# Altium project 435MHz_LNA.PrjPCB
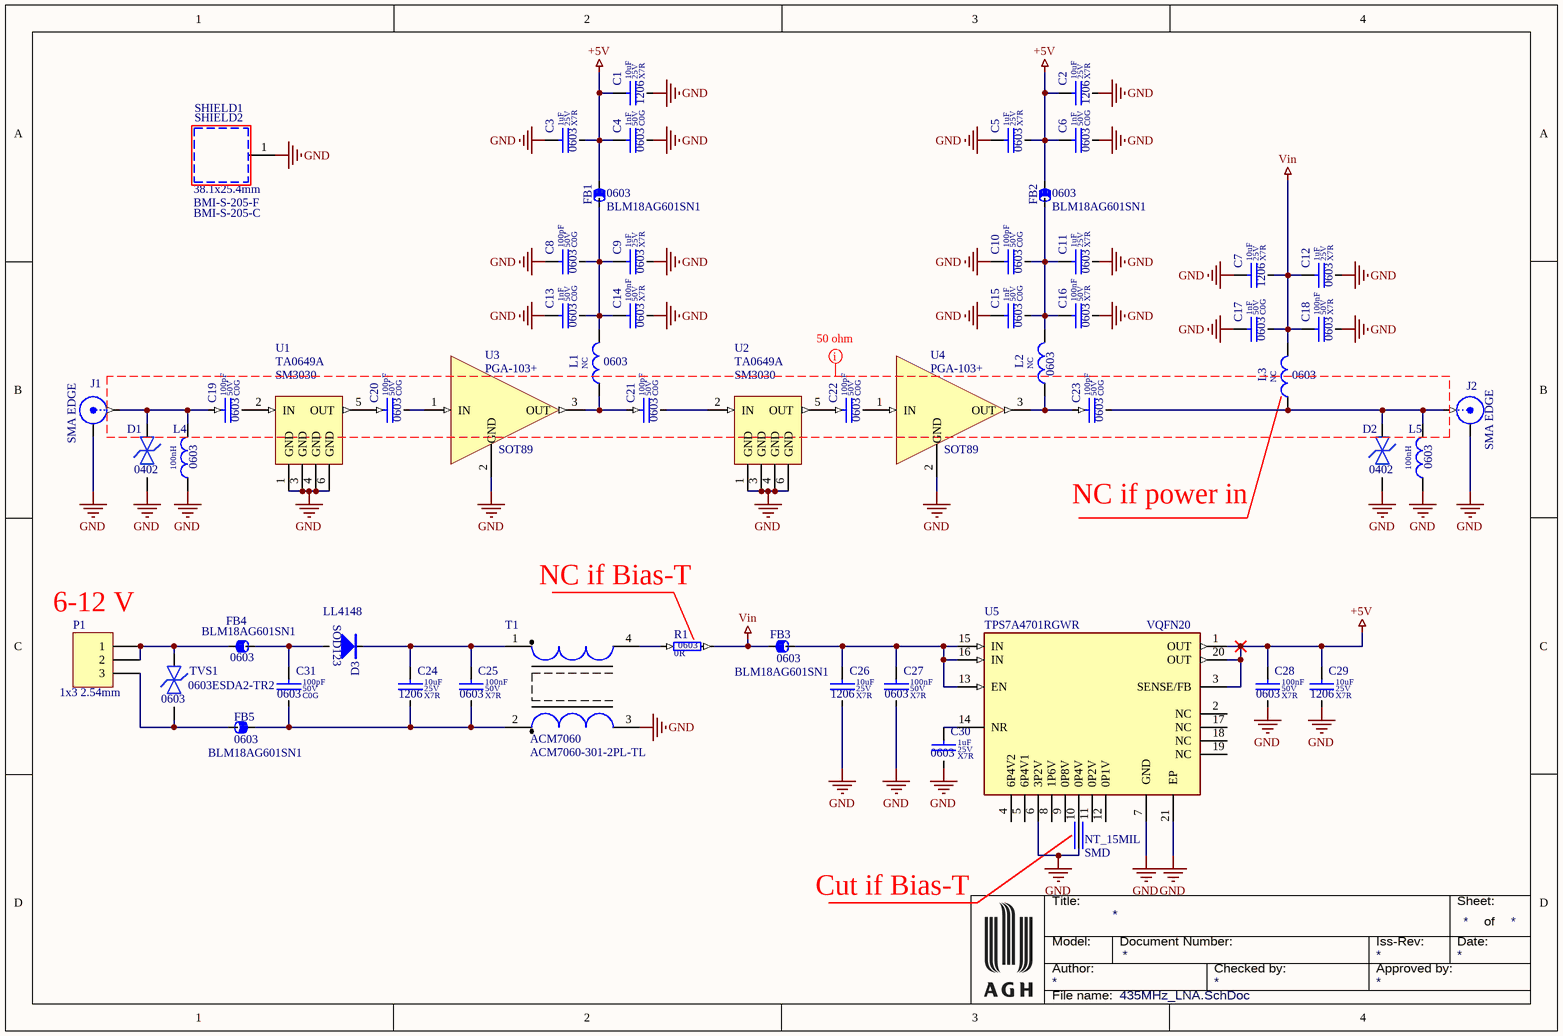
[diagram p0: 435MHz_LNA.SchDoc]
1 sheet, 58 parts. Net scope: global (net labels, ports and power ports of the same name join across sheets).
Board file: 435MHz_LNA.PcbDoc

## Sheet 435MHz_LNA.SchDoc
size A4

### Parts
C1  value 10uF  Dielectric: X7R  Voltage: 25V  SCH_Footprint: 1206  [C_1206_3216]  (hidden comment: Ceramic X7R)
C2  value 10uF  Dielectric: X7R  Voltage: 25V  SCH_Footprint: 1206  [C_1206_3216]  (hidden comment: Ceramic X7R)
C3  value 1uF  Dielectric: X7R  Voltage: 25V  SCH_Footprint: 0603  [C_0603_1608]  (hidden comment: Ceramic X7R)
C4  value 1nF  Dielectric: C0G  Voltage: 50V  SCH_Footprint: 0603  [C_0603_1608]  (hidden comment: Ceramic C0G)
C5  value 1uF  Dielectric: X7R  Voltage: 25V  SCH_Footprint: 0603  [C_0603_1608]  (hidden comment: Ceramic X7R)
C6  value 1nF  Dielectric: C0G  Voltage: 50V  SCH_Footprint: 0603  [C_0603_1608]  (hidden comment: Ceramic C0G)
C7  value 10uF  Dielectric: X7R  Voltage: 25V  SCH_Footprint: 1206  [C_1206_3216]  (hidden comment: Ceramic X7R)
C8  value 100pF  Dielectric: C0G  Voltage: 50V  SCH_Footprint: 0603  [C_0603_1608]  (hidden comment: Ceramic C0G)
C9  value 1uF  Dielectric: X7R  Voltage: 25V  SCH_Footprint: 0603  [C_0603_1608]  (hidden comment: Ceramic X7R)
C10  value 100pF  Dielectric: C0G  Voltage: 50V  SCH_Footprint: 0603  [C_0603_1608]  (hidden comment: Ceramic C0G)
C11  value 1uF  Dielectric: X7R  Voltage: 25V  SCH_Footprint: 0603  [C_0603_1608]  (hidden comment: Ceramic X7R)
C12  value 1uF  Dielectric: X7R  Voltage: 25V  SCH_Footprint: 0603  [C_0603_1608]  (hidden comment: Ceramic X7R)
C13  value 1nF  Dielectric: C0G  Voltage: 50V  SCH_Footprint: 0603  [C_0603_1608]  (hidden comment: Ceramic C0G)
C14  value 100nF  Dielectric: X7R  Voltage: 50V  SCH_Footprint: 0603  [C_0603_1608]  (hidden comment: Ceramic X7R)
C15  value 1nF  Dielectric: C0G  Voltage: 50V  SCH_Footprint: 0603  [C_0603_1608]  (hidden comment: Ceramic C0G)
C16  value 100nF  Dielectric: X7R  Voltage: 50V  SCH_Footprint: 0603  [C_0603_1608]  (hidden comment: Ceramic X7R)
C17  value 1nF  Dielectric: C0G  Voltage: 50V  SCH_Footprint: 0603  [C_0603_1608]  (hidden comment: Ceramic C0G)
C18  value 100nF  Dielectric: X7R  Voltage: 50V  SCH_Footprint: 0603  [C_0603_1608]  (hidden comment: Ceramic X7R)
C19  value 100pF  Dielectric: C0G  Voltage: 50V  SCH_Footprint: 0603  [C_0603_1608]  (hidden comment: Ceramic C0G)
C20  value 100pF  Dielectric: C0G  Voltage: 50V  SCH_Footprint: 0603  [C_0603_1608]  (hidden comment: Ceramic C0G)
C21  value 100pF  Dielectric: C0G  Voltage: 50V  SCH_Footprint: 0603  [C_0603_1608]  (hidden comment: Ceramic C0G)
C22  value 100pF  Dielectric: C0G  Voltage: 50V  SCH_Footprint: 0603  [C_0603_1608]  (hidden comment: Ceramic C0G)
C23  value 100pF  Dielectric: C0G  Voltage: 50V  SCH_Footprint: 0603  [C_0603_1608]  (hidden comment: Ceramic C0G)
C24  value 10uF  Dielectric: X7R  Voltage: 25V  SCH_Footprint: 1206  [C_1206_3216]  (hidden comment: Ceramic X7R)
C25  value 100nF  Dielectric: X7R  Voltage: 50V  SCH_Footprint: 0603  [C_0603_1608]  (hidden comment: Ceramic X7R)
C26  value 10uF  Dielectric: X7R  Voltage: 25V  SCH_Footprint: 1206  [C_1206_3216]  (hidden comment: Ceramic X7R)
C27  value 100nF  Dielectric: X7R  Voltage: 50V  SCH_Footprint: 0603  [C_0603_1608]  (hidden comment: Ceramic X7R)
C28  value 100nF  Dielectric: X7R  Voltage: 50V  SCH_Footprint: 0603  [C_0603_1608]  (hidden comment: Ceramic X7R)
C29  value 10uF  Dielectric: X7R  Voltage: 25V  SCH_Footprint: 1206  [C_1206_3216]  (hidden comment: Ceramic X7R)
C30  value 1uF  Dielectric: X7R  Voltage: 25V  SCH_Footprint: 0603  [C_0603_1608]  (hidden comment: Ceramic X7R)
C31  value 100pF  Dielectric: C0G  Voltage: 50V  SCH_Footprint: 0603  [C_0603_1608]  (hidden comment: Ceramic C0G)
D1  SCH_Footprint: 0402  [D_BI_0402_1005]  (hidden comment: ESD Suppressors / TVS Diodes)
D2  SCH_Footprint: 0402  [D_BI_0402_1005]  (hidden comment: ESD Suppressors / TVS Diodes)
D3  value LL4148  [SOD123]  (hidden comment: 1N4148W)
FB1  value BLM18AG601SN1  SCH_Footprint: 0603  [FB_0603_1608]  (hidden comment: Ferrite bead)
FB2  value BLM18AG601SN1  SCH_Footprint: 0603  [FB_0603_1608]  (hidden comment: Ferrite bead)
FB3  value BLM18AG601SN1  SCH_Footprint: 0603  [FB_0603_1608]  (hidden comment: Ferrite bead)
FB4  value BLM18AG601SN1  SCH_Footprint: 0603  [FB_0603_1608]  (hidden comment: Ferrite bead)
FB5  value BLM18AG601SN1  SCH_Footprint: 0603  [FB_0603_1608]  (hidden comment: Ferrite bead)
J1  SMA EDGE  [J_SMA_EDGE_6.25]
J2  SMA EDGE  [J_SMA_EDGE_6.25]
L1  value NC  SCH_Footprint: 0603  [L_0603_1608]  (hidden comment: L)
L2  value NC  SCH_Footprint: 0603  [L_0603_1608]  (hidden comment: L)
L3  value NC  SCH_Footprint: 0603  [L_0603_1608]  (hidden comment: L)
L4  value 100nH  SCH_Footprint: 0603  [L_0603_1608]  (hidden comment: Inductor)
L5  value 100nH  SCH_Footprint: 0603  [L_0603_1608]  (hidden comment: Inductor)
NT1  value NT_15MIL  SCH_Footprint: SMD  [NT_15MIL]  (hidden comment: NETTIE 15MIL)  (net tie, no BOM)
P1  SCH_Footprint: 1x3 2.54mm  [P_HEADER_1x3_2.54]  (hidden comment: Goldpin)
R1  value 0R  SCH_Footprint: 0603  [R_0603_1608]  (hidden comment: Resistor)
SHIELD1  value BMI-S-205-C  [BMI-S-205-C]  (hidden comment: EMI Shield Cover)
SHIELD2  value BMI-S-205-F  SCH_Footprint: 38.1x25.4mm  [BMI-S-205-F]  (hidden comment: EMI Shield)
T1  value ACM7060-301-2PL-TL  [ACM7060]  (hidden comment: Common mode filter)
TVS1  value 0603ESDA2-TR2  SCH_Footprint: 0603  [R_0603_1608]  (hidden comment: 0603ESDA2)
U1  SCH_Footprint: SM3030  [SAW_DCC6_SM3030-6_3x3]  (hidden comment: TA0649A)
U2  SCH_Footprint: SM3030  [SAW_DCC6_SM3030-6_3x3]  (hidden comment: TA0649A)
U3  value PGA-103+  SCH_Footprint: SOT89  [SOT89_TO-243AA_N]  (hidden comment: PGA103+)
U4  value PGA-103+  SCH_Footprint: SOT89  [SOT89_TO-243AA_N]  (hidden comment: PGA103+)
U5  SCH_Footprint: VQFN20  [QFN20_5x5]  (hidden comment: TPS7A4701RGWR)

### Nets
+5V: C1.1 C2.1 C3.2 C4.1 C5.2 C6.1 C28.1 C29.1 FB1.1 FB2.1 U5.1(OUT) U5.3(SENSE/FB) U5.20(OUT)
GND: C1.2 C2.2 C3.1 C4.2 C5.1 C6.2 C7.1 C8.1 C9.2 C10.1 C11.2 C12.2 C13.1 C14.2 C15.1 C16.2 C17.1 C18.2 C26.2 C27.2 C28.2 C29.2 C30.2 D1.2 D2.2 J1.2(Y) J2.2(Y) L4.1 L5.1 NT1.1 SHIELD2.1(shield) T1.3 U1.1(GND) U1.3(GND) U1.4(GND) U1.6(GND) U2.1(GND) U2.3(GND) U2.4(GND) U2.6(GND) U3.2(GND) U4.2(GND) U5.6(3P2V) U5.7(GND) U5.21(EP)
Vin: C7.2 C12.1 C17.2 C18.1 FB3.1 L3.2 R1.2
NetC8_2: C8.2 C9.1 C13.2 C14.1 FB1.2 L1.2
NetC10_2: C10.2 C11.1 C15.2 C16.1 FB2.2 L2.2
NetC19_1: C19.1 D1.1 J1.1(X) L4.2
NetC19_2: C19.2 U1.2(IN)
NetC20_1: C20.1 U1.5(OUT)
NetC20_2: C20.2 U3.1(IN)
NetC21_1: C21.1 L1.1 U3.3(OUT)
NetC21_2: C21.2 U2.2(IN)
NetC22_1: C22.1 U2.5(OUT)
NetC22_2: C22.2 U4.1(IN)
NetC23_1: C23.1 L2.1 U4.3(OUT)
NetC23_2: C23.2 D2.1 J2.1(X) L3.1 L5.2
NetC24_1: C24.1 C25.1 D3.1 T1.1
NetC24_2: C24.2 C25.2 C31.2 FB5.1 T1.2
NetC26_1: C26.1 C27.1 FB3.2 U5.13(EN) U5.15(IN) U5.16(IN)
NetC30_1: C30.1 U5.14(NR)
NetC31_1: C31.1 D3.2 FB4.2
NetFB4_1: FB4.1 P1.1 P1.2 TVS1.1
NetFB5_2: FB5.2 P1.3 TVS1.2
NetNT1_2: NT1.2 U5.10(0P4V)
NetR1_1: R1.1 T1.4

Not connected (* = marked no-connect by the designer): U5 2(NC) 4(6P4V2) 5(6P4V1) 8(1P6V) 9(0P8V) 11(0P2V) 12(0P1V) 17(NC) 18(NC) 19(NC)

### Layout directives
net class 50 ohm: (no net found under the mark)

### Notes on the sheet
- NC if power in
- (near P1) 6-12 V
- NC if Bias-T
- Cut if Bias-T
- Title:
- Sheet:
- of
- Author:
- Model:
- Document Number:
- Checked by:
- Iss-Rev:
- Approved by:
- Date:
- File name:

### Library data of the parts
C1 C2 C7 C24 C26 C29 = C_10uF_25V_X7R_1206_10: Capacitor; Manufacturer: Samsung Electro-Mechanics; Manufacturer Part Number: CL31B106KAHNNNE; Tolerance (%): 10; Part Number: C_10uF_25V_X7R_1206_10; HelpURL: http://www.tme.eu/pl/Document/4a42202b32dab16128fe107dd69598cc/samsung-chip-cap.pdf; Supplier 1: TME; Supplier Part Number 1: CL31B106KAHNNNE; Supplier 2: RS Components; Supplier 3: Farnell; Supplier 4: Mouser; Supplier 5: Digi-Key
C3 C5 C9 C11 C12 C30 = C_1uF_25V_X7R_0603_10: Capacitor; Manufacturer: Samsung; Manufacturer Part Number: CL10B105KA8NNNC; Tolerance (%): 10; Part Number: C_1uF_25V_X7R_0603_10; HelpURL: http://www.tme.eu/pl/Document/4a42202b32dab16128fe107dd69598cc/samsung-chip-cap.pdf; Supplier 1: TME; Supplier Part Number 1: CL10B105KA8NNNC; Supplier 2: RS Components; Supplier 3: Farnell; Supplier 4: Mouser; Supplier 5: Digi-Key
C4 C6 C13 C15 C17 = C_1nF_50V_C0G_0603_5: Capacitor; Manufacturer: Samsung; Manufacturer Part Number: CL10C102JB8NNNC; Tolerance (%): 5; Part Number: C_1nF_50V_C0G_0603_5; HelpURL: http://www.tme.eu/pl/Document/7da762c1dbaf553c64ad9c40d3603826/mlcc_samsung.pdf; Supplier 1: TME; Supplier Part Number 1: CL10C102JB8NNNC; Supplier 2: RS Components; Supplier 3: Farnell; Supplier 4: Mouser; Supplier 5: Digi-Key
C8 C10 C19-C23 C31 = C_100pF_50V_C0G_0603_5: Capacitor; Manufacturer: AVX; Manufacturer Part Number: 06035A101JAT2A; Tolerance (%): 5; Part Number: C_100pF_50V_C0G_0603_5; HelpURL: http://www.tme.eu/pl/Document/28556c2a4dfa60995042b7f5f1edb9ed/AVX-C0G.pdf; Supplier 1: TME; Supplier Part Number 1: 06035A101JAT2A; Supplier 2: RS Components; Supplier 3: Farnell; Supplier 4: Mouser; Supplier 5: Digi-Key
C14 C16 C18 C25 C27 C28 = C_100nF_50V_X7R_0603_5: Capacitor; Manufacturer: Samsung; Manufacturer Part Number: CL10B104JB8NNNC; Tolerance (%): 5; Part Number: C_100nF_50V_X7R_0603_5; HelpURL: http://www.tme.eu/pl/Document/4a42202b32dab16128fe107dd69598cc/samsung-chip-cap.pdf; Supplier 1: TME; Supplier Part Number 1: CL10B104JB8NNNC; Supplier 2: RS Components; Supplier 3: Farnell; Supplier 4: Mouser; Supplier 5: Digi-Key
D1 D2 = TVS_PS04LTVA1: Manufacturer: Bussmann; Voltage: 12V; Part Number: TVS_PS04LTVA1; Value: PS04LTVA1; HelpURL: https://pl.mouser.com/datasheet/2/87/31fc02c3-c2a7-4757-9ba5-5a4597d899a4-33212.pdf; Manufacturer Part Number: PS04LTVA1; Supplier 1: TME; Supplier 2: RS Components; Supplier 3: Farnell; Supplier 4: Mouser; Supplier Part Number 4: 504-PS04LTVA1; Supplier 5: Digi-Key
D3 = D_1N4148W_0A15_75V_SOD123: Manufacturer: Fairchild Semiconductor; Voltage: 75V; Current: 0A15; Part Number: D_1N4148W_0A15_75V_SOD123; SCH_Footprint: SOD123; Manufacturer Part Number: LL4148; Supplier 1: TME; Supplier 2: RS Components; Supplier 3: Farnell; Supplier 4: Mouser; Supplier Part Number 4: 771-PMLL4148L-T/R; Supplier 5: Digi-Key; Supplier Part Number 5: LL4148FSCT
FB1-FB5 = FB_BLM18AG601SN1: Manufacturer: Murata; Manufacturer Part Number: BLM18AG601SN1D; Current: 0A5; Resistance: 600R; Part Number: FB_BLM18AG601SN1; HelpURL: http://datasheet.octopart.com/BLM18AG601SN1D-Murata-datasheet-11743096.pdf; Supplier 1: TME; Supplier 2: RS Components; Supplier Part Number 2: 7241299P; Supplier 3: Farnell; Supplier Part Number 3: 1515679; Supplier 4: Mouser; Supplier Part Number 4: 81-BLM11A601S; Supplier 5: Digi-Key; Supplier Part Number 5: 490-1014-1-ND
J1 J2 = J_SMA_EDGE_6.25: SMA connector; Manufacturer: Adam Tech; Value: RF2-143-T-17-50-G; Part Number: J_SMA_EDGE_6.25; SCH_Footprint: SMA EDGE; Component Type: Standard; HelpURL: http://www.tme.eu/pl/Document/5895dbb620da9c3499391e7670c4adea/RF2-143-T-17-50-G.pdf; Manufacturer Part Number: RF2-143-T-17-50-G; Supplier 1: TME; Supplier Part Number 1: RF2-143-T-17-50-G; Supplier 2: RS Components; Supplier 3: Farnell; Supplier 4: Mouser; Supplier 5: Digi-Key
L1-L3 = L_0603: Induction; Part Number: L_0603; Supplier 1: TME; Supplier 2: RS Components; Supplier 3: Farnell; Supplier 4: Mouser; Supplier 5: Digi-Key
L4 L5 = L_100NH_0A3_0603: Induction; Manufacturer: Bourns; Manufacturer Part Number: CI160808-R10J; Current: 0A3; Resistance: 1R7; Part Number: L_100NH_0A3_0603; HelpURL: https://datasheet.octopart.com/CI160808-8N2J-Bourns-datasheet-2719.pdf; Supplier 1: TME; Supplier 2: RS Components; Supplier 3: Farnell; Supplier 4: Mouser; Supplier 5: Digi-Key
NT1 = NT_15MIL: Part Number: NT_15MIL; Component Type: Net Tie (No BOM); Supplier 1: TME; Supplier 2: RS Components; Supplier 3: Farnell; Supplier 4: Mouser; Supplier 5: Digi-Key
P1 = P_HEADER_1x3_2.54: Header, 3-Pin; Manufacturer: Connfly; Value: DS1021-1*3SF1-1; Part Number: P_HEADER_1x3_2.54; Component Type: Standard; HelpURL: http://www.tme.eu/en/Document/cc301e58a5da78cb543a94b5a5b7f06a/DS1021.pdf; Manufacturer Part Number: DS1021-1*3SF1-1; Supplier 1: TME; Supplier Part Number 1: ZL201-03G; Supplier 2: RS Components; Supplier 3: Farnell; Supplier 4: Mouser; Supplier 5: Digi-Key
R1 = R_0R_0603: Manufacturer Part Number: RC1608J000CS; Part Number: R_0R_0603; Supplier 1: TME; Supplier 2: RS Components; Supplier 3: Farnell; Supplier 4: Mouser; Supplier 5: Digi-Key; Supplier Part Number 5: 1276-3510-1-ND
SHIELD1 = SHIELD_BMI-S-205-C: Shield, 1 pad; Manufacturer: Laird; SCH_Footprint: 38.1x25.4mm; Part Number: SHIELD_BMI-S-205-C; HelpURL: https://assets.lairdtech.com/home/brandworld/files/Board%20Level%20Shields%20Catalog%20Download.pdf; Manufacturer Part Number: BMI-S-205-C; Supplier 1: TME; Supplier 2: RS Components; Supplier 3: Farnell; Supplier Part Number 3: 2497722; Supplier 4: Mouser; Supplier Part Number 4: 739-BMIS-205-C; Supplier 5: Digi-Key; Supplier Part Number 5: 903-1017-ND
SHIELD2 = SHIELD_BMI-S-205-F: Shield, 1 pad; Manufacturer: Laird; Part Number: SHIELD_BMI-S-205-F; HelpURL: https://assets.lairdtech.com/home/brandworld/files/Board%20Level%20Shields%20Catalog%20Download.pdf; Manufacturer Part Number: BMI-S-205-F; Supplier 1: TME; Supplier 2: RS Components; Supplier 3: Farnell; Supplier Part Number 3: 2497723; Supplier 4: Mouser; Supplier Part Number 4: 739-BMIS-205-F; Supplier 5: Digi-Key; Supplier Part Number 5: 903-1054-1-ND
T1 = ACM7060-301-2PL-TL: TDK ACM7060 common mode filter; Voltage: 80; Current: 5; Resistance: 0.01R; Part Number: ACM7060-301-2PL-TL; SCH_Footprint: ACM7060; HelpURL: https://pl.mouser.com/datasheet/2/400/mf_commercial_power_acm7060_en-837183.pdf; Manufacturer: TDK; Manufacturer Part Number: ACM7060-301-2PL-TL; Supplier 1: TME; Supplier 2: RS Components; Supplier 3: Farnell; Supplier Part Number 3: 1503723; Supplier 4: Mouser; Supplier Part Number 4: 810-ACM70603012PLTL; Supplier 5: Digi-Key; Supplier Part Number 5: 445-2214-1-ND
TVS1 = TVS_0603ESDA2: Manufacturer: Bussmann; Voltage: 14V; Current: 30A; Part Number: TVS_0603ESDA2; HelpURL: http://www.cooperindustries.com/content/dam/public/bussmann/Electronics/Resources/product-datasheets/bus-elx-ds-4419-0603esda2-tr2.pdf; Manufacturer Part Number: 0603ESDA2-TR2; Supplier 1: TME; Supplier Part Number 1: 0603ESDA2-TR2; Supplier 2: RS Components; Supplier 3: Farnell; Supplier 4: Mouser; Supplier Part Number 4: 504-0603ESDA2-TR2; Supplier 5: Digi-Key; Supplier Part Number 5: 283-4156-1-ND
U1 U2 = U_TA0649A: Manufacturer: Tai-Saw; Center Frequency (MHz): 433.92; Bandwidth (MHz): 8; Max Power (dBm): 10; Manufacturer Part Number: TA0649A; Part Number: U_TA0649A; Value: TA0649A; HelpURL: https://www.golledge.com/media/2065/ma09182.pdf; Supplier 1: TME; Supplier 2: RS Components; Supplier 3: Farnell; Supplier 4: Mouser; Supplier 5: Digi-Key
U3 U4 = U_PGA103+: Manufacturer: Mini-Circuits; Part Number: U_PGA103+; HelpURL: https://ww2.minicircuits.com/pdfs/PGA-103+.pdf; Manufacturer Part Number: PGA-103+; Supplier 1: TME; Supplier 2: RS Components; Supplier 3: Farnell; Supplier 4: Mouser; Supplier 5: Digi-Key
U5 = VL_TPS7A4701RGWR_ADJ_1A: RF LDO Voltage Regulator; Manufacturer: Texas Instruments; Voltage: ADJ; Current: 1A; Part Number: VL_TPS7A4701RGWR_ADJ_1A; Value: TPS7A4701RGWR; HelpURL: http://www.ti.com/lit/ds/symlink/tps7a47.pdf; Manufacturer Part Number: TPS7A4701RGWR; Supplier 1: TME; Supplier 2: RS Components; Supplier 3: Farnell; Supplier Part Number 3: 2542798; Supplier 4: Mouser; Supplier Part Number 4: 595-TPS7A4701RGWR; Supplier 5: Digi-Key; Supplier Part Number 5: 296-37224-1-ND

## Assembly variants
BatterySupply: not fitted C7 C12 C17 C18 L3
BiasT: not fitted C24 C25 D3 L5 NT1 P1 R1 T1 TVS1